# EAGLE design slave (EAGLE 7.0.0)
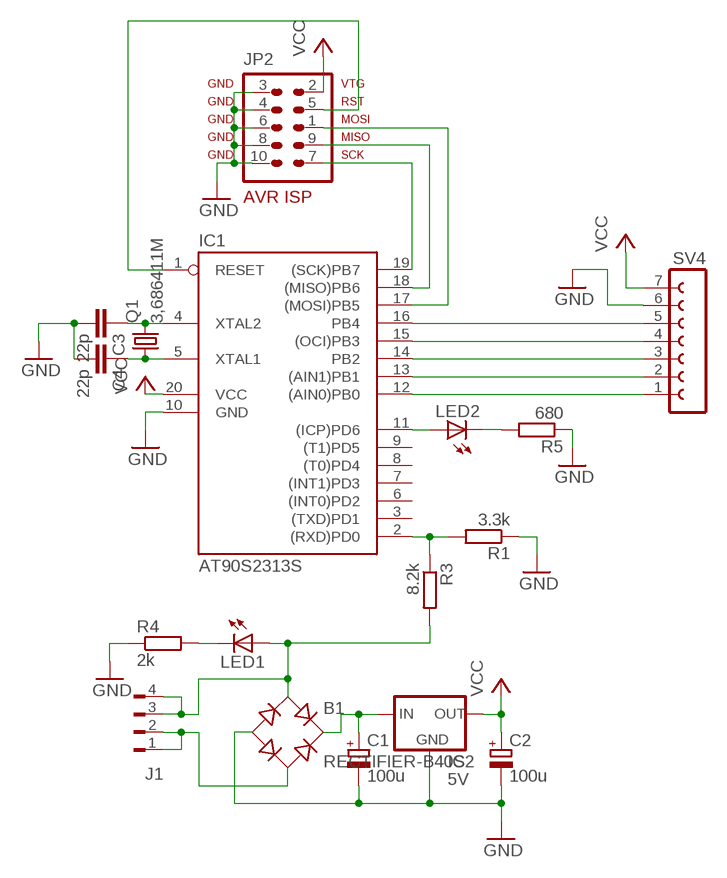
[diagram p0: schematic, sheet 1]

## Parts
B1  RECTIFIER-B40S  [B40S]
C1  100u  CPOL-EUE2.5-6  [E2,5-6]
C2  100u  CPOL-EUE2.5-6  [E2,5-6]
C3  22p  C-EU025-025X050  [C025-025X050]
C4  22p  C-EU025-025X050  [C025-025X050]
IC1  AT90S2313S  [SO20L]
IC2  5V  78XXS  [78XXS]
J1  FLOPPY-4  [FLOPPY-4]
JP2  AVR-ISP-10  [AVR-ISP-10]
LED1  LED3MM  [LED3MM]
LED2  LED3MM  [LED3MM]
Q1  3,686411M  CRYSTALHC49U-V  [HC49U-V]
R1  3.3k  R-EU_R1206W  [R1206W]
R3  8.2k  R-EU_R1206W  [R1206W]
R4  2k  R-EU_R1206W  [R1206W]
R5  680  R-EU_R1206W  [R1206W]
SV4  FE07-1  [FE07]

## Nets
GND: B1.- C1.- C2.- C3.2 C4.2 IC1.10(GND) IC2.GND JP2.3 JP2.4 JP2.6 JP2.8 JP2.10 R1.1 R4.1 R5.1 SV4.6
N$1: B1.+ C1.+ IC2.IN
N$2: IC1.2((RXD)PD0) R1.2 R3.1
N$3: LED1.K(C) R4.2
N$4: IC1.11((ICP)PD6) LED2.A
N$5: IC1.12((AIN0)PB0) SV4.1
N$6: B1.AC1 J1.3 J1.4 LED1.A R3.2
N$7: C3.1 IC1.4(XTAL2) Q1.2
N$8: IC1.13((AIN1)PB1) SV4.2
N$9: IC1.14(PB2) SV4.3
N$10: B1.AC2 J1.1 J1.2
N$11: LED2.K(C) R5.2
N$12: IC1.19((SCK)PB7) JP2.7
N$13: IC1.18((MISO)PB6) JP2.9
N$14: IC1.17((MOSI)PB5) JP2.1
N$15: IC1.1(RESET) JP2.5
N$16: C4.1 IC1.5(XTAL1) Q1.1
N$17: IC1.15((OCI)PB3) SV4.4
N$18: IC1.16(PB4) SV4.5
VCC: C2.+ IC1.20(VCC) IC2.OUT JP2.2 SV4.7
Unconnected: IC1.3((TXD)PD1) IC1.6((INT0)PD2) IC1.7((INT1)PD3) IC1.8((T0)PD4) IC1.9((T1)PD5)

## Library data of the parts
B1 = rectifier:RECTIFIER-: Rectifier
C1 C2 = resistor:CPOL-EU: POLARIZED CAPACITOR, European symbol
C3 C4 = resistor:C-EU: CAPACITOR, European symbol
IC1 = atmel:AT90S2313: MICROCONTROLLER 2 Kbytes FLASH 128 bytes SRAM 128 bytes EEPROM UART; OC_FARNELL: unknown; OC_NEWARK: unknown
IC2 = v-reg:78XXS: VOLTAGE REGULATOR
J1 = con-amp:FLOPPY-4: MATE N-LOCK Floppy / HDD conector Distributor: Bürklin 71F970
JP2 = avr-7:AVR-ISP-10: AVR ISP-10 Serial Programming Header
LED1 LED2 = led:LED: LED OSRAM: - CHIPLED LG R971, LG N971, LY N971, LG Q971, LY Q971, LO R971, LY R971 LH N974, LH R974 LS Q976, LO Q976, LY Q976 LO Q996 - Hyper CHIPLED LW Q18S LB Q993, LB Q99A, LB R99A - SideLED LS A670, LO A670, LY A670, LG A670, LP A670 LB A673, LV A673, LT A673, LW A673 LH A674 LY A675 LS A676, LA A676, LO A676, LY A676, LW A676 LS A679, LY A679, LG A679 - Hyper Micro SIDELED® LS Y876, LA Y876, LO Y876, LY Y876 LT Y87S - SmartLED LW L88C, LW L88S LB L89C, LB L89S, LG L890 LS L89K, LO L89K, LY L89K LS L896, LA L896, LO L896, LY L896 - TOPLED LS T670, LO T670, LY T670, LG T670, LP T670 LSG T670, LSP T670, LSY T670, LOP T670, LYG T670 LG T671, LOG T671, LSG T671 LB T673, LV T673, LT T673, LW T673 LH T674 LS T676, LA T676, LO T676, LY T676, LB T676, LH T676, LSB T676, LW T676 LB T67C, LV T67C, LT T67C, LS T67K, LO T67K, LY T67K, LW E67C LS E67B, LA E67B, LO E67B, LY E67B, LB E67C, LV E67C, LT E67C LW T67C LS T679, LY T679, LG T679 LS T770, LO T770, LY T770, LG T770, LP T770 LB T773, LV T773, LT T773, LW T773 LH T774 LS E675, LA E675, LY E675, LS T675 LS T776, LA T776, LO T776, LY T776, LB T776 LHGB T686 LT T68C, LB T68C - Hyper Mini TOPLED® LB M676 - Mini TOPLED Santana® LG M470 LS M47K, LO M47K, LY M47K Source: http://www.osram.convergy.de LUXEON: - LUMILED® LXK2-PW12-R00, LXK2-PW12-S00, LXK2-PW14-U00, LXK2-PW14-V00 LXK2-PM12-R00, LXK2-PM12-S00, LXK2-PM14-U00 LXK2-PE12-Q00, LXK2-PE12-R00, LXK2-PE12-S00, LXK2-PE14-T00, LXK2-PE14-U00 LXK2-PB12-K00, LXK2-PB12-L00, LXK2-PB12-M00, LXK2-PB14-N00, LXK2-PB14-P00, LXK2-PB14-Q00 LXK2-PR12-L00, LXK2-PR12-M00, LXK2-PR14-Q00, LXK2-PR14-R00 LXK2-PD12-Q00, LXK2-PD12-R00, LXK2-PD12-S00 LXK2-PH12-R00, LXK2-PH12-S00 LXK2-PL12-P00, LXK2-PL12-Q00, LXK2-PL12-R00 Source: www.luxeon.com KINGBRIGHT: KA-3528ASYC Source: www.kingbright.com
Q1 = crystal:CRYSTAL: CRYSTAL; OC_FARNELL: 1666969; OC_NEWARK: unknown
R1 R3-R5 = resistor:R-EU_: RESISTOR, European symbol
SV4 = con-lsta:FE07-1: FEMALE HEADER; OC_FARNELL: unknown; OC_NEWARK: unknown

## Board
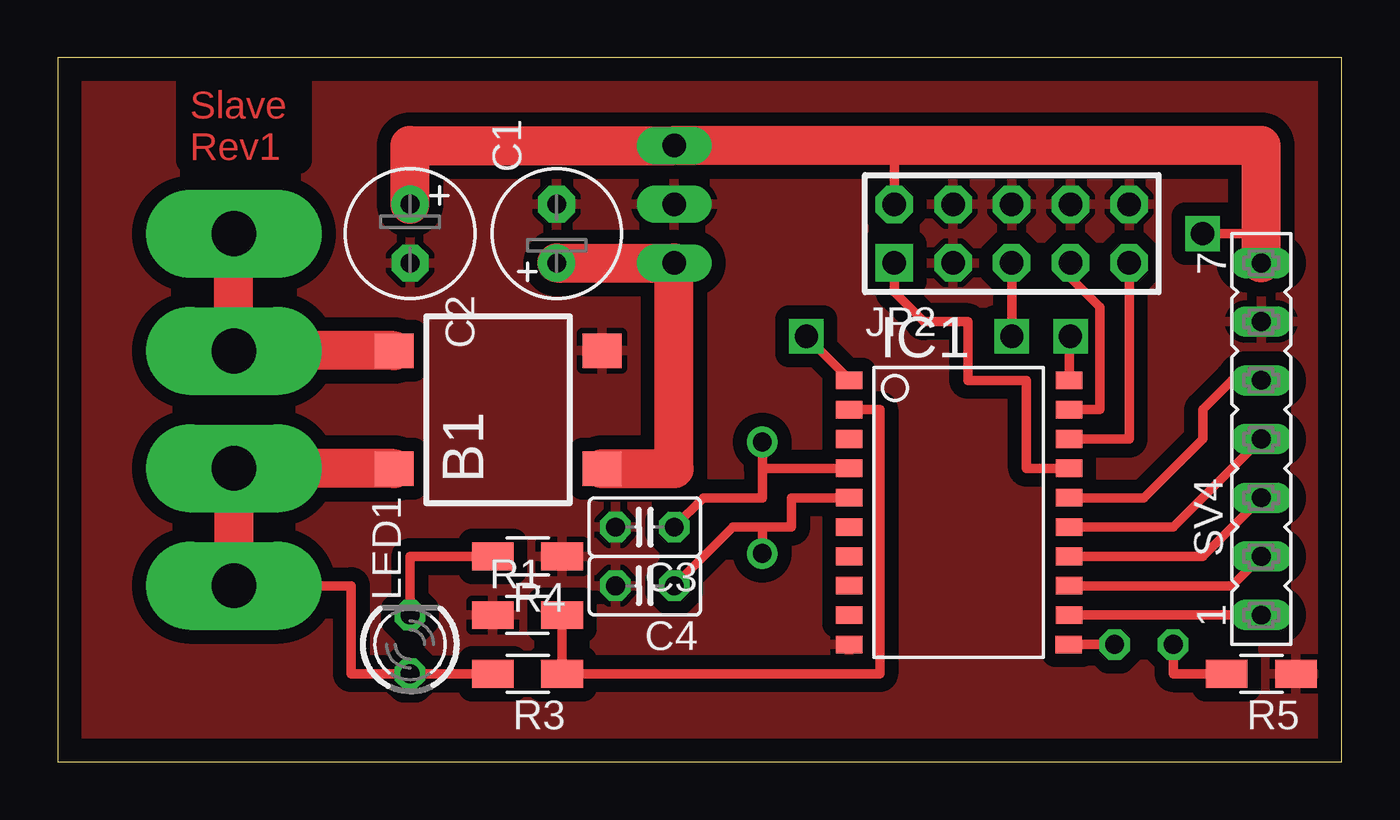
[diagram p1: board, top side]
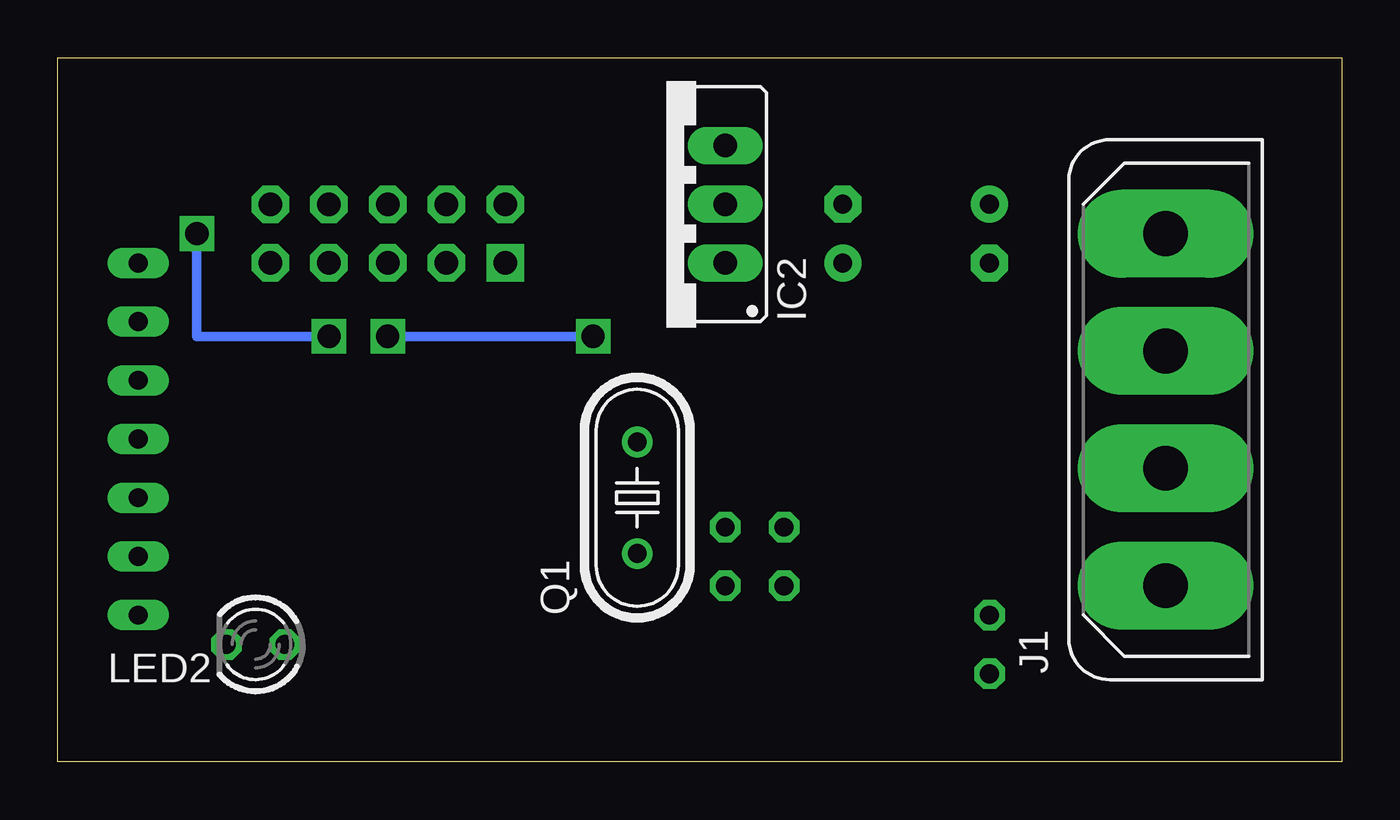
[diagram p2: board, bottom side, seen from below]

Size 55.55 x 30.47 mm. Coordinates in mm from the lower left corner, seen from the top.
Outline: 0,0 55.55,0 55.55,30.47 0,30.47 0,0
Copper layers (1*16): Top 0.035mm / dielectric 1.5mm / Bottom 0.035mm
Design rules "default *": minimum track width 10mil, minimum drill 1mm, track to track 8mil, track to pad 8mil, pad to pad 8mil, via to via 8mil, smd to smd 8mil, copper to edge 40mil, drill to drill 8mil, minimum pad ring 10mil, minimum via ring 8mil, stop-mask expansion 4mil, vias tented up to drill 0mil, thermal gap 10mil

### Footprints (pad centres in the part's own frame; a part is rotated, then mirrored left to right if it is on the bottom)
B40S = smd 1.5 x 1.7: + -2.55,-4.5; - 2.55,-4.5; AC1 -2.55,4.5; AC2 2.55,4.5
E2,5-6 = drill 0.813 pad 1.6: + -1.27,0 | drill 0.813 pad 1.6 octagon: - 1.27,0
C025-025X050 = drill 0.813 octagon: 1 -1.27,0; 2 1.27,0
SO20L = smd 0.762 x 1.143: 1 -5.08,-5.131; 2 -3.81,-5.131; 3 -2.54,-5.131; 4 -1.27,-5.131; 5 0,-5.131; 6 1.27,-5.131; 7 2.54,-5.131; 8 3.81,-5.131; 9 5.08,-5.131; 10 6.35,-5.131; 11 6.35,4.369; 12 5.08,4.394; 13 3.81,4.394; 14 2.54,4.394; 15 1.27,4.394; 16 0,4.394; 17 -1.27,4.394; 18 -2.54,4.394; 19 -3.81,4.394; 20 -5.08,4.394
78XXS = drill 1.016 long: GND 0,-2.54; IN -2.54,-2.54; OUT 2.54,-2.54
FLOPPY-4 = drill 1.93 pad 3.81 long: 1 7.62,0; 2 2.54,0; 3 -2.54,0; 4 -7.62,0
AVR-ISP-10 = drill 1.016 square: 1 -5.08,-1.27 | drill 1.016 octagon: 2 -5.08,1.27; 3 -2.54,-1.27; 4 -2.54,1.27; 5 0,-1.27; 6 0,1.27; 7 2.54,-1.27; 8 2.54,1.27; 9 5.08,-1.27; 10 5.08,1.27
LED3MM = drill 0.813 octagon: A -1.27,0; K 1.27,0
HC49U-V = drill 0.813: 1 -2.413,0; 2 2.413,0
R1206W = smd 1.8 x 1.2: 1 -1.499,0; 2 1.499,0
FE07 = drill 0.813 long: 1 -7.62,0; 2 -5.08,0; 3 -2.54,0; 4 0,0; 5 2.54,0; 6 5.08,0; 7 7.62,0

### Placement (x,y rotation side)
B1  19.05,15.24 90 top
C1  21.59,22.86 90 top
C2  15.24,22.86 270 top
C3  25.4,10.16 180 top
C4  25.4,7.62 180 top
IC1  39.37,11.43 270 top
IC2  29.21,24.13 90 bottom
J1  7.62,15.24 90 bottom
JP2  41.27,22.86 0 top
LED1  15.24,5.08 90 top
LED2  46.99,5.08 180 bottom
Q1  30.48,11.43 90 bottom
R1  20.32,6.35 0 top
R3  20.32,3.81 180 top
R4  20.32,8.89 180 top
R5  52.07,3.81 180 top
SV4  52.07,13.97 90 top

### Tracks (layer width: path | path; a pad name or v marks a point on that pad's centre or on a via)
GND
  pour Top (isolate 0.6): 0,30.48 55.88,30.48 55.88,0 0,0
N$1
  Top 1.676: B1.+ 26.67,12.69 IC2.IN C1.+
N$2
  Top 0.406: R1.2 R3.1 35.56,3.81 35.56,15.24 IC1.2
N$3
  Top 0.406: LED1.K 15.24,8.89 R4.2
N$4
  Top 0.406: IC1.11 LED2.A
N$5
  Top 0.406: IC1.12 SV4.1
N$6
  Top 0.406: R3.2 LED1.A 12.7,3.81 12.7,7.62 J1.4
  Top 1.676: J1.4 J1.3 B1.AC1
N$7
  Top 0.406: IC1.4 30.48,12.7 Q1.2 30.48,11.43 27.94,11.43 C3.1
N$8
  Top 0.406: IC1.13 50.8,7.62 SV4.2
N$9
  Top 0.406: IC1.14 49.53,8.89 SV4.3
N$10
  Top 1.676: J1.1 J1.2 B1.AC2
N$11
  Top 0.406: LED2.K 48.26,3.81 R5.2
N$12
  Top 0.406: IC1.19 45.09,15.24 45.09,19.68 43.81,20.95 JP2.7
N$13
  Top 0.406: IC1.18 46.35,13.97 JP2.9
N$14
  Top 0.406: IC1.17 41.91,12.7 41.91,16.51 39.37,16.51 39.37,19.05 37.46,19.05 36.2,20.32 JP2.1
N$15  (via drill 1)
  Top 0.406: IC1.1 34.24,16.56 v32.38,18.41 | v41.27,18.41 JP2.5
  Bottom 0.406: v32.38,18.41 v41.27,18.41
N$16
  Top 0.406: IC1.5 31.75,11.43 31.75,10.16 30.48,10.16 | 30.48,10.16 29.21,10.16 C4.1 | Q1.1 30.48,10.16
N$17
  Top 0.406: IC1.15 48.26,10.16 SV4.4
N$18
  Top 0.406: IC1.16 46.99,11.43 49.53,13.97 49.53,15.24 50.8,16.51 SV4.5
VCC  (via drill 1)
  Top 0.406: JP2.2 36.2,26.67 | IC1.20 43.76,18.41 v43.81,18.41 | v49.53,22.86 52.07,22.86
  Top 1.676: C2.+ 15.24,26.67 IC2.OUT 36.2,26.67 52.07,26.67 52.07,22.86 SV4.7
  Bottom 0.406: v43.81,18.41 49.53,18.41 v49.53,22.86

### Text on the board
Top: Slave / Rev1